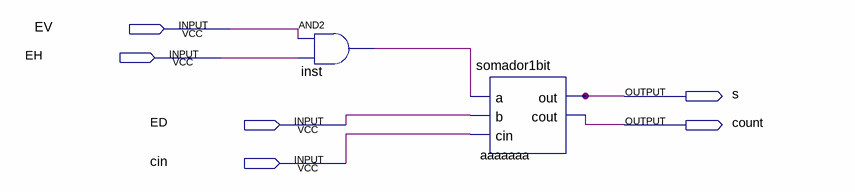
[diagram p0: schematic sheet]
// Quartus schematic ModulobMultiplicador.bdf as structural Verilog: 2 symbols, 6 pins
module ModulobMultiplicador (
  input  EV,
  input  EH,
  input  ED,
  input  cin,
  output s,
  output count
);

  wire inst_out;

  and inst (inst_out, EV, EH);
  somador1bit aaaaaaa (.a(inst_out), .b(ED), .cin(cin), .out(s), .cout(count));
endmodule
